# Altium schematic sheet 平衡车.SchDoc
size A4
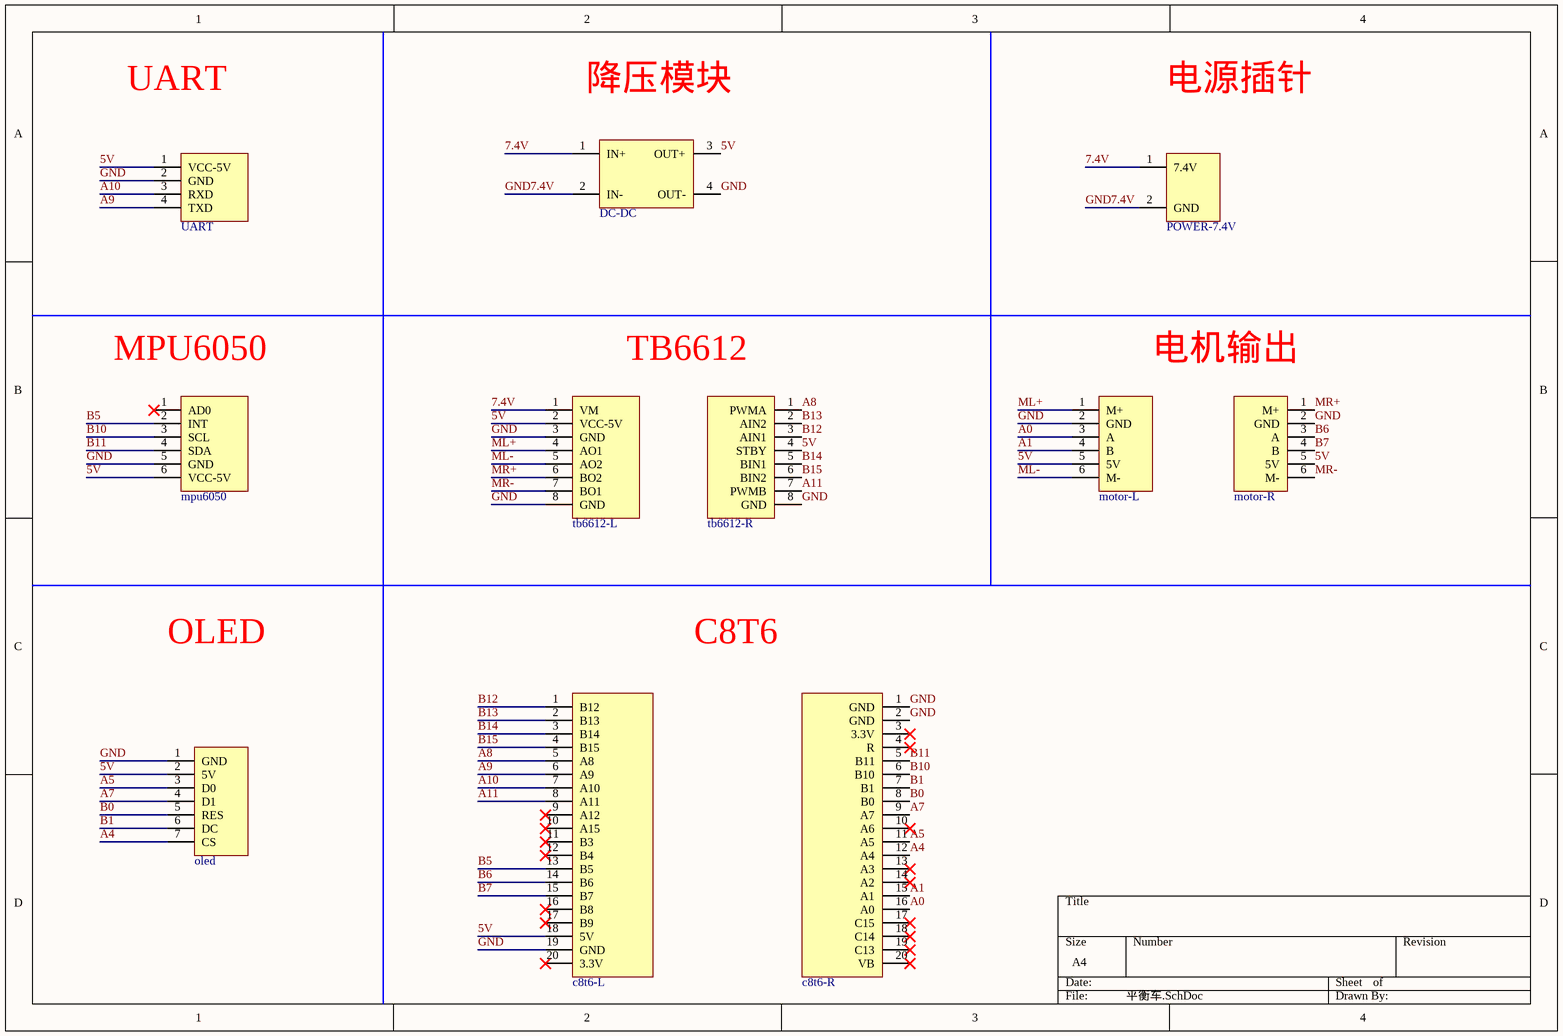
[diagram p0: 平衡车.SchDoc]

## Parts
c8t6-L  c8t6-L  [HDR2.54-M-LI-20P]
c8t6-R  c8t6-R  [HDR2.54-M-LI-20P]
DC-DC  DC-DC  [DC-DC]
motor-L  motor-L  [HDR2.54-WI-6P]
motor-R  motor-R  [HDR2.54-WI-6P]
mpu6050  mpu6050  [HDR2.54-M-LI-6P]
oled  oled  [HDR2.54-M-LI-7P]
POWER-7.4V  POWER-7.4V  [HDR2.54-LI-2P]
tb6612-L  tb6612-L  [HDR2.54-M-LI-8P]
tb6612-R  tb6612-R  [HDR2.54-M-LI-8P]
UART  UART  [HDR2.54-M-LI-4P]

## Nets
5V: c8t6-L.18(5V) DC-DC.3(OUT+) motor-L.5(5V) motor-R.5(5V) mpu6050.6(VCC-5V) oled.2(5V) tb6612-L.2(VCC-5V) tb6612-R.4(STBY) UART.1(VCC-5V)
7.4V: DC-DC.1(IN+) POWER-7.4V.1(7.4V) tb6612-L.1(VM)
A0: c8t6-R.16(A0) motor-L.3(A)
A1: c8t6-R.15(A1) motor-L.4(B)
A4: c8t6-R.12(A4) oled.7(CS)
A5: c8t6-R.11(A5) oled.3(D0)
A7: c8t6-R.9(A7) oled.4(D1)
A8: c8t6-L.5(A8) tb6612-R.1(PWMA)
A9: c8t6-L.6(A9) UART.4(TXD)
A10: c8t6-L.7(A10) UART.3(RXD)
A11: c8t6-L.8(A11) tb6612-R.7(PWMB)
B0: c8t6-R.8(B0) oled.5(RES)
B1: c8t6-R.7(B1) oled.6(DC)
B5: c8t6-L.13(B5) mpu6050.2(INT)
B6: c8t6-L.14(B6) motor-R.3(A)
B7: c8t6-L.15(B7) motor-R.4(B)
B10: c8t6-R.6(B10) mpu6050.3(SCL)
B11: c8t6-R.5(B11) mpu6050.4(SDA)
B12: c8t6-L.1(B12) tb6612-R.3(AIN1)
B13: c8t6-L.2(B13) tb6612-R.2(AIN2)
B14: c8t6-L.3(B14) tb6612-R.5(BIN1)
B15: c8t6-L.4(B15) tb6612-R.6(BIN2)
GND: c8t6-L.19(GND) c8t6-R.1(GND) c8t6-R.2(GND) DC-DC.4(OUT-) motor-L.2(GND) motor-R.2(GND) mpu6050.5(GND) oled.1(GND) tb6612-L.3(GND) tb6612-L.8(GND) tb6612-R.8(GND) UART.2(GND)
GND7.4V: DC-DC.2(IN-) POWER-7.4V.2(GND)
ML+: motor-L.1(M+) tb6612-L.4(AO1)
ML-: motor-L.6(M-) tb6612-L.5(AO2)
MR+: motor-R.1(M+) tb6612-L.6(BO2)
MR-: motor-R.6(M-) tb6612-L.7(BO1)

Not connected (* = marked no-connect by the designer): c8t6-L 9(A12)* 10(A15)* 11(B3)* 12(B4)* 16(B8)* 17(B9)* 20(3.3V)*; c8t6-R 3(3.3V)* 4(R)* 10(A6)* 13(A3)* 14(A2)* 17(C15)* 18(C14)* 19(C13)* 20(VB)*; mpu6050 1(AD0)*

## Notes on the sheet
- UART
- 降压模块
- 电源插针
- (near mpu6050) MPU6050
- TB6612
- 电机输出
- OLED
- C8T6